# EAGLE design PLT-01-RevEe (EAGLE 9.6.2)
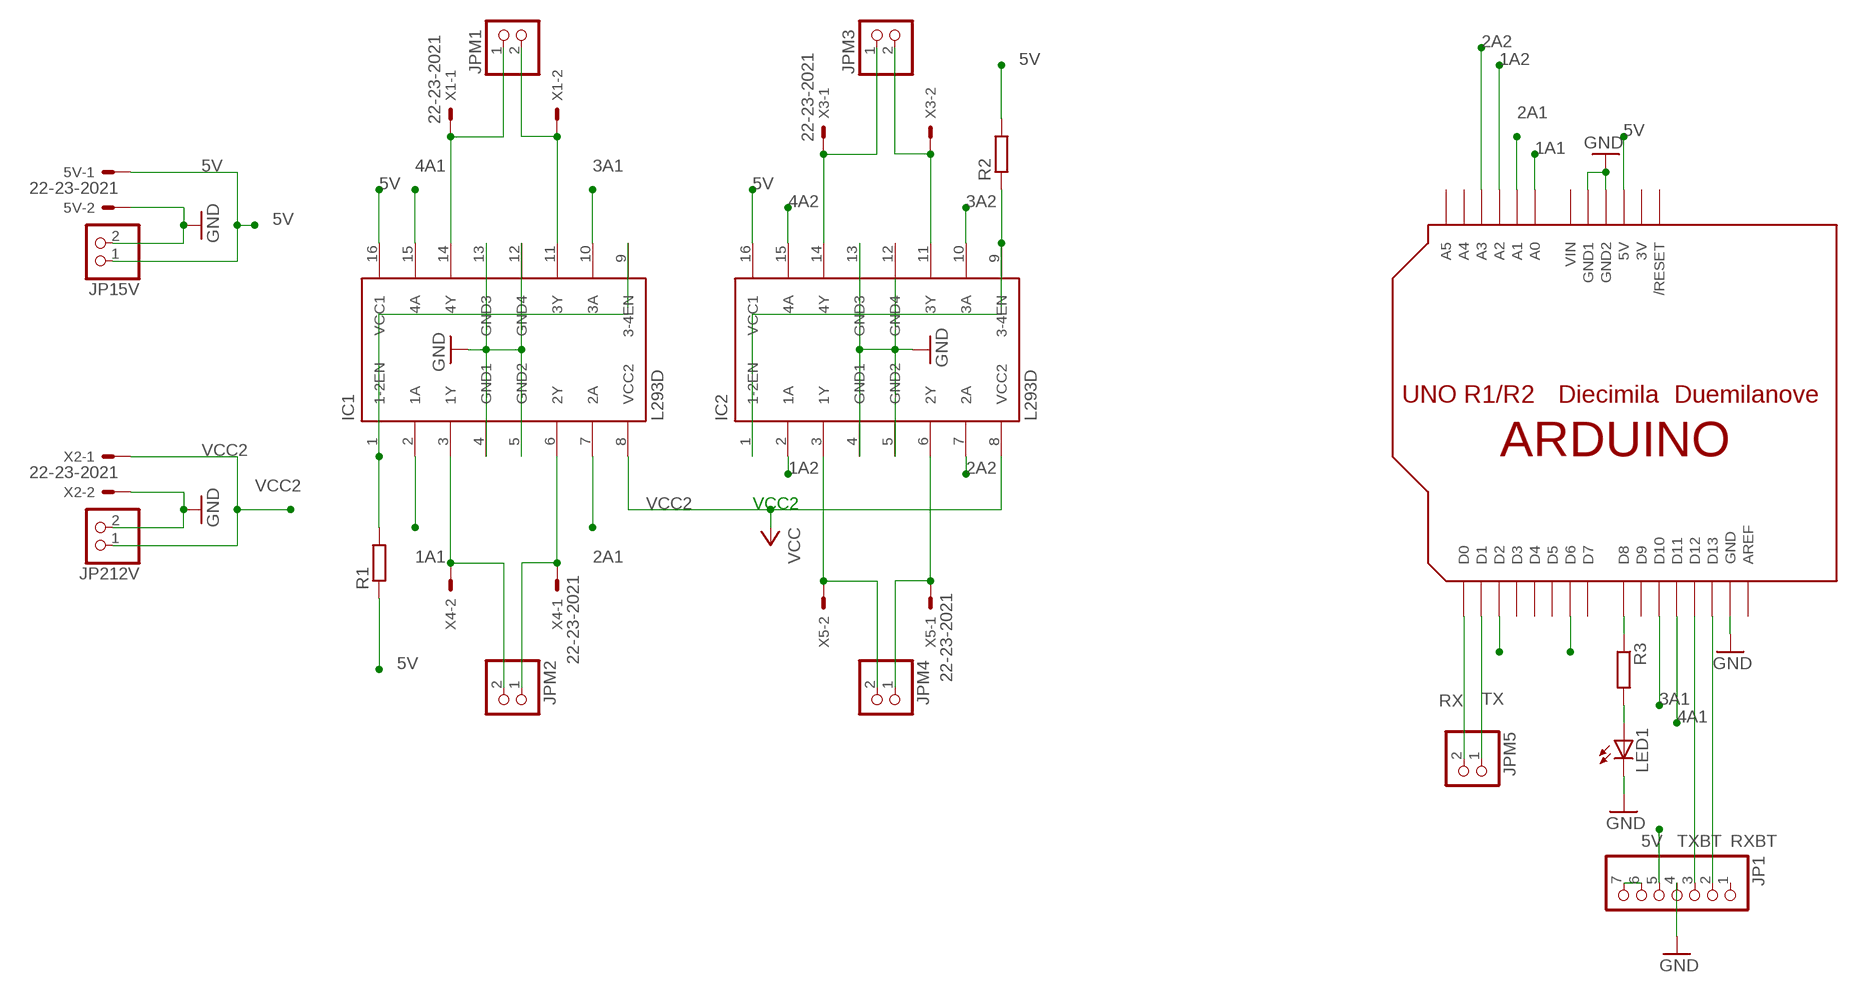
[diagram p0: schematic, sheet 1]

## Parts
5V  22-23-2021  [22-23-2021]
IC1  L293D  [DIL16]
IC2  L293D  [DIL16]
JP1  PINHD-1X7  [1X07]
JP15V  PINHD-1X2  [1X02]
JP212V  PINHD-1X2  [1X02]
JPM1  PINHD-1X2  [1X02]
JPM2  PINHD-1X2  [1X02]
JPM3  PINHD-1X2  [1X02]
JPM4  PINHD-1X2  [1X02]
JPM5  PINHD-1X2  [1X02]
LED1  LED5MM  [LED5MM]
R1  R-EU_0207/10  [0207/10]
R2  R-EU_0207/10  [0207/10]
R3  R-EU_0207/10  [0207/10]
U$1  ARDUINOUNO  [ARDUINO]
X1  22-23-2021  [22-23-2021]
X2  22-23-2021  [22-23-2021]
X3  22-23-2021  [22-23-2021]
X4  22-23-2021  [22-23-2021]
X5  22-23-2021  [22-23-2021]

## Nets
1A1: IC1.2(1A) U$1.A0
1A2: IC2.2(1A) U$1.A2
2A1: IC1.7(2A) U$1.A1
2A2: IC2.7(2A) U$1.A3
3A1: IC1.10(3A) U$1.D10
3A2: IC2.10(3A) U$1.D2
4A1: IC1.15(4A) U$1.D11
4A2: IC2.15(4A) U$1.D6
5V: 5V.1 IC1.16(VCC1) IC2.16(VCC1) JP1.5 JP15V.1 R1.1 R2.2 U$1.5V
GND: 5V.2 IC1.4(GND1) IC1.5(GND2) IC1.12(GND4) IC1.13(GND3) IC2.4(GND1) IC2.5(GND2) IC2.13(GND3) JP1.4 JP15V.2 JP212V.2 LED1.K(C) U$1.GND U$1.GND1 U$1.GND2 X2.2
N$1: IC1.3(1Y) JPM2.2 X4.2
N$2: IC1.6(2Y) JPM2.1 X4.1
N$3: IC2.3(1Y) JPM4.2 X5.2
N$4: IC2.6(2Y) JPM4.1 X5.1
N$5: IC2.14(4Y) JPM3.1 X3.1
N$6: IC2.11(3Y) JPM3.2 X3.2
N$7: IC1.14(4Y) JPM1.1 X1.1
N$8: IC1.11(3Y) JPM1.2 X1.2
N$9: IC2.1(1-2EN) IC2.9(3-4EN) R2.1
N$10: R3.1 U$1.D8
N$11: IC1.1(1-2EN) IC1.9(3-4EN) R1.2
N$12: LED1.A R3.2
N$13: JP1.6 JP1.7
RX: JPM5.2 U$1.D0
RXBT: JP1.2 U$1.D13
TX: JPM5.1 U$1.D1
TXBT: JP1.3 U$1.D12
VCC2: IC1.8(VCC2) IC2.8(VCC2) JP212V.1 X2.1 ; supply symbol labelled VCC
Unconnected: JP1.1 U$1.A4 U$1.A5 U$1.AREF U$1.D3 U$1.D4 U$1.D5 U$1.D7 U$1.D9 U$1.RESET(/RESET)

## Notes on the sheet
- VCC2

## Power pins joined to a net without a drawn wire
3V: U$1.3V
GND4: IC2.12(GND4)
VIN: U$1.VIN

## Library data of the parts
5V X1-X5 = con-molex:22-23-2021: .100" (2.54mm) Center Header - 2 Pin; MF: MOLEX; MPN: 22-23-2021; OC_FARNELL: 1462926; OC_NEWARK: 25C3832
IC1 IC2 = st-microelectronics:L293D: PUSH-PULL 4 CHANNEL DRIVER; MPN: L293D; OC_FARNELL: 9589619; OC_NEWARK: 56P8249
JP1 = pinhead:PINHD-1X7: PIN HEADER
JP15V JP212V JPM1-JPM5 = pinhead:PINHD-1X2: PIN HEADER
LED1 = led:LED: LED OSRAM: - CHIPLED LG R971, LG N971, LY N971, LG Q971, LY Q971, LO R971, LY R971 LH N974, LH R974 LS Q976, LO Q976, LY Q976 LO Q996 - Hyper CHIPLED LW Q18S LB Q993, LB Q99A, LB R99A - SideLED LS A670, LO A670, LY A670, LG A670, LP A670 LB A673, LV A673, LT A673, LW A673 LH A674 LY A675 LS A676, LA A676, LO A676, LY A676, LW A676 LS A679, LY A679, LG A679 - Hyper Micro SIDELED® LS Y876, LA Y876, LO Y876, LY Y876 LT Y87S - SmartLED LW L88C, LW L88S LB L89C, LB L89S, LG L890 LS L89K, LO L89K, LY L89K LS L896, LA L896, LO L896, LY L896 - TOPLED LS T670, LO T670, LY T670, LG T670, LP T670 LSG T670, LSP T670, LSY T670, LOP T670, LYG T670 LG T671, LOG T671, LSG T671 LB T673, LV T673, LT T673, LW T673 LH T674 LS T676, LA T676, LO T676, LY T676, LB T676, LH T676, LSB T676, LW T676 LB T67C, LV T67C, LT T67C, LS T67K, LO T67K, LY T67K, LW E67C LS E67B, LA E67B, LO E67B, LY E67B, LB E67C, LV E67C, LT E67C LW T67C LS T679, LY T679, LG T679 LS T770, LO T770, LY T770, LG T770, LP T770 LB T773, LV T773, LT T773, LW T773 LH T774 LS E675, LA E675, LY E675, LS T675 LS T776, LA T776, LO T776, LY T776, LB T776 LHGB T686 LT T68C, LB T68C - Hyper Mini TOPLED® LB M676 - Mini TOPLED Santana® LG M470 LS M47K, LO M47K, LY M47K Source: http://www.osram.convergy.de LUXEON: - LUMILED® LXK2-PW12-R00, LXK2-PW12-S00, LXK2-PW14-U00, LXK2-PW14-V00 LXK2-PM12-R00, LXK2-PM12-S00, LXK2-PM14-U00 LXK2-PE12-Q00, LXK2-PE12-R00, LXK2-PE12-S00, LXK2-PE14-T00, LXK2-PE14-U00 LXK2-PB12-K00, LXK2-PB12-L00, LXK2-PB12-M00, LXK2-PB14-N00, LXK2-PB14-P00, LXK2-PB14-Q00 LXK2-PR12-L00, LXK2-PR12-M00, LXK2-PR14-Q00, LXK2-PR14-R00 LXK2-PD12-Q00, LXK2-PD12-R00, LXK2-PD12-S00 LXK2-PH12-R00, LXK2-PH12-S00 LXK2-PL12-P00, LXK2-PL12-Q00, LXK2-PL12-R00 Source: www.luxeon.com KINGBRIGHT: KA-3528ASYC Source: www.kingbright.com
R1-R3 = resistor:R-EU_: RESISTOR, European symbol
U$1 = adafruit:ARDUINO: Arduino Diecimila/Duemilanove Make a shield with ease, this package has all the named pins as well as the two mounting drill holes and an outline of the USB and DC power connector. The outline is on the DIMENSION layer, so if your board house uses it they will cut the outline to match. http://www.ladyada.net/library/pcb/eaglelibrary.html

## Board
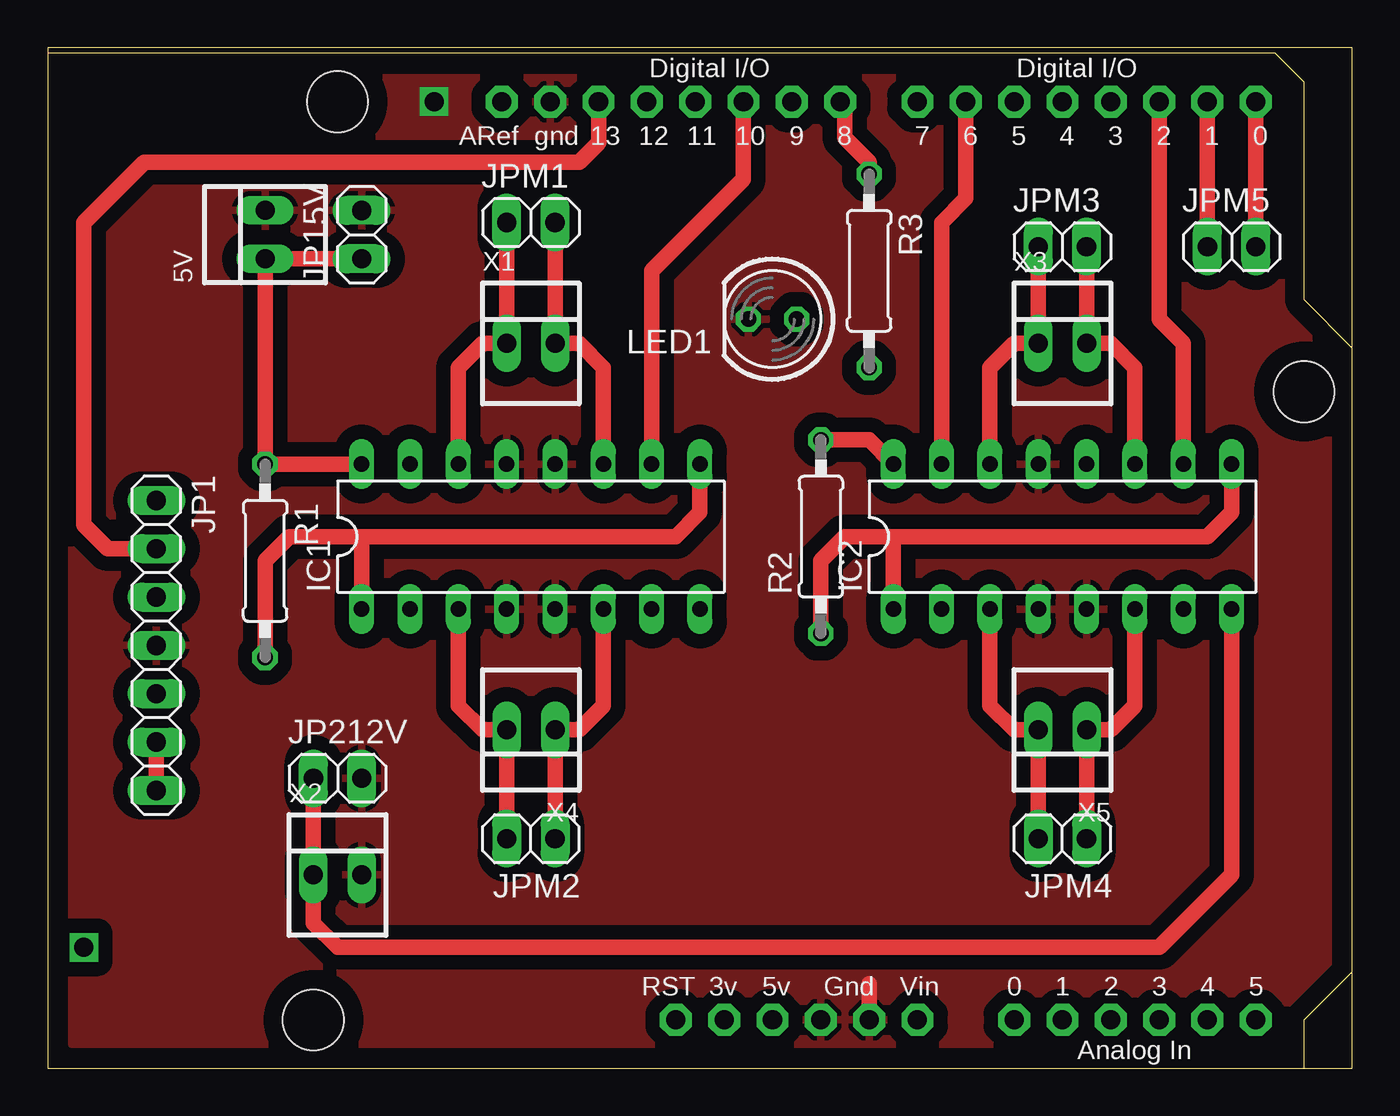
[diagram p1: board, top side]
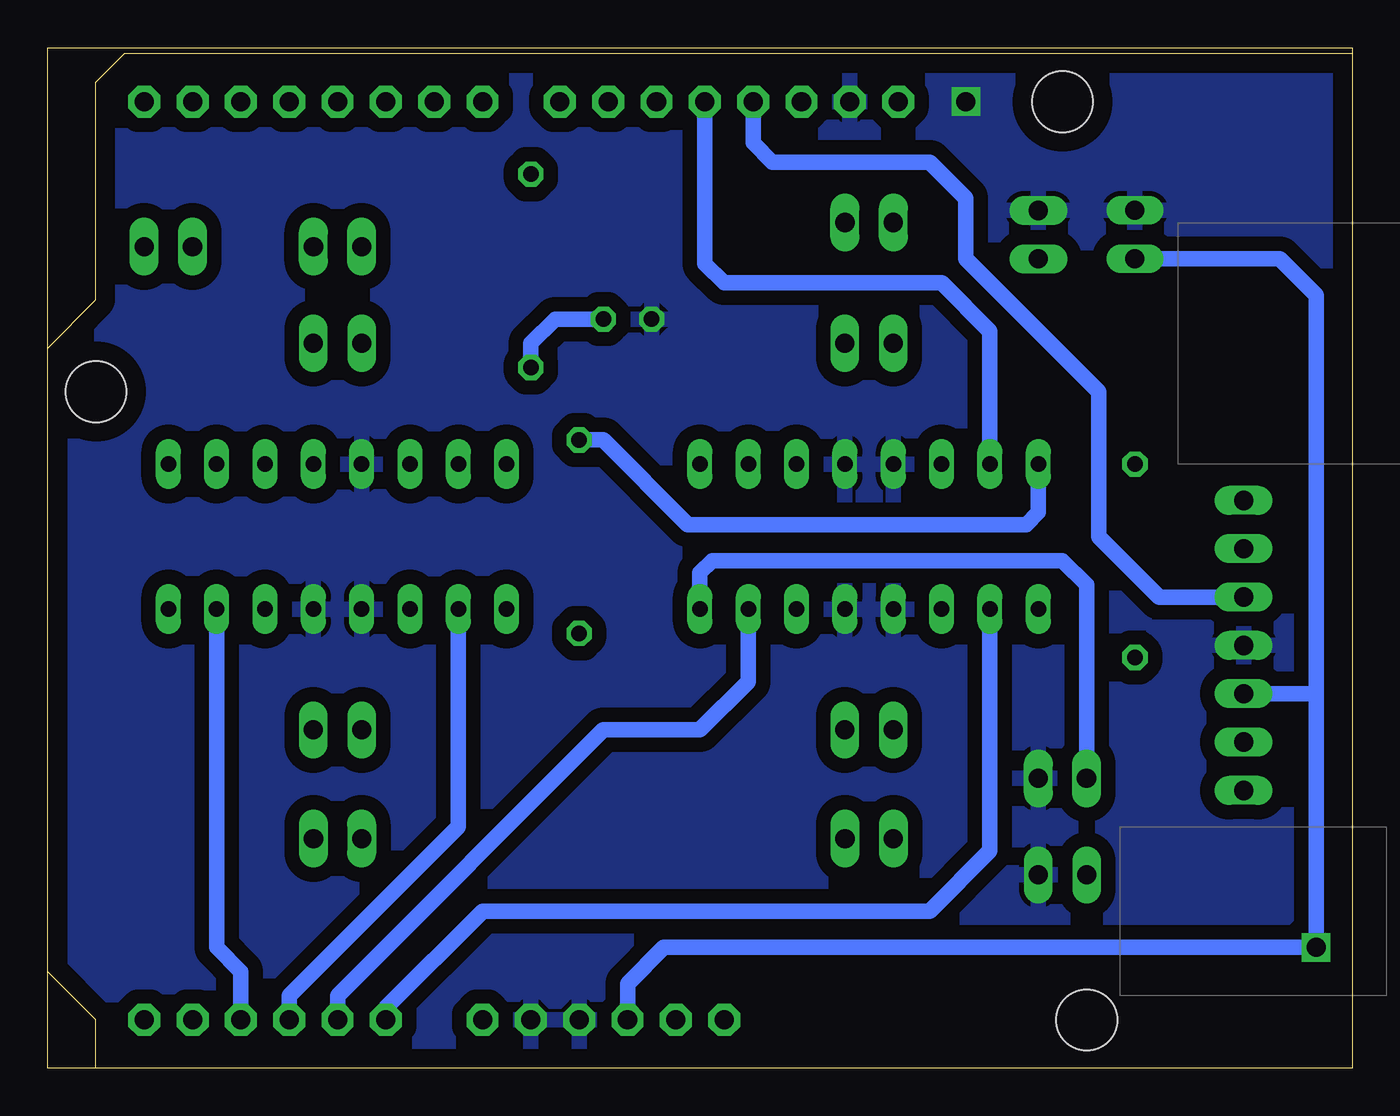
[diagram p2: board, bottom side, seen from below]

Size 68.58 x 53.64 mm. Coordinates in mm from the lower left corner, seen from the top.
Outline: 0,0 68.56,0 68.56,53.64 0,53.64 0,0
Copper layers (1*16): Top 0.035mm / dielectric 1.5mm / Bottom 0.035mm
Design rules "default *": minimum track width 10mil, minimum drill 24mil, track to track 30mil, track to pad 30mil, pad to pad 30mil, via to via 30mil, smd to smd 30mil, copper to edge 40mil, drill to drill 8mil, minimum pad ring 10mil, minimum via ring 8mil, stop-mask expansion 4mil, vias tented up to drill 0mil, thermal gap 10mil

### Footprints (pad centres in the part's own frame; a part is rotated, then mirrored left to right if it is on the bottom)
22-23-2021 = drill 1 long: 1 -1.27,0; 2 1.27,0
DIL16 = drill 0.813 long: 1 -8.89,-3.81; 2 -6.35,-3.81; 3 -3.81,-3.81; 4 -1.27,-3.81; 5 1.27,-3.81; 6 3.81,-3.81; 7 6.35,-3.81; 8 8.89,-3.81; 9 8.89,3.81; 10 6.35,3.81; 11 3.81,3.81; 12 1.27,3.81; 13 -1.27,3.81; 14 -3.81,3.81; 15 -6.35,3.81; 16 -8.89,3.81
1X07 = drill 1.016 long: 1 -7.62,0; 2 -5.08,0; 3 -2.54,0; 4 0,0; 5 2.54,0; 6 5.08,0; 7 7.62,0
1X02 = drill 1.016 long: 1 -1.27,0; 2 1.27,0
LED5MM = drill 0.813 octagon: A -1.27,0; K 1.27,0
0207/10 = drill 0.813 octagon: 1 -5.08,0; 2 5.08,0
ARDUINO = drill 1 pad 1.676 octagon: 3V 35.56,2.54; 5V 38.1,2.54; A0 50.8,2.54; A1 53.34,2.54; A2 55.88,2.54; A3 58.42,2.54; A4 60.96,2.54; A5 63.5,2.54; AREF 23.876,50.8; D0 63.5,50.8; D1 60.96,50.8; D2 58.42,50.8; D3 55.88,50.8; D4 53.34,50.8; D5 50.8,50.8; D6 48.26,50.8; D7 45.72,50.8; D8 41.656,50.8; D9 39.116,50.8; D10 36.576,50.8; D11 34.036,50.8; D12 31.496,50.8; D13 28.956,50.8; GND 26.416,50.8; GND1 43.18,2.54; GND2 40.64,2.54; RESET 33.02,2.54; VIN 45.72,2.54 | hole 3.2: 15.24,50.8; 66.04,35.56; 13.97,2.54

### Placement (x,y rotation side)
5V  11.43,43.81 90 top
IC1  25.4,27.94 0 top
IC2  53.34,27.94 0 top
JP1  5.71,22.23 270 top
JP15V  16.51,43.81 90 top
JP212V  15.24,15.24 0 top
JPM1  25.4,44.45 0 top
JPM2  25.4,12.06 180 top
JPM3  53.34,43.18 0 top
JPM4  53.34,12.06 180 top
JPM5  62.23,43.18 0 top
LED1  38.1,39.37 180 top
R1  11.43,26.67 270 top
R2  40.64,27.94 90 top
R3  43.18,41.91 270 top
U$1  0,0 0 top
X1  25.4,38.1 0 top
X2  15.24,10.16 0 top
X3  53.34,38.1 0 top
X4  25.4,17.78 180 top
X5  53.34,17.78 180 top

### Tracks (layer width: path | path; a pad name or v marks a point on that pad's centre or on a via)
1A1
  Bottom 0.813: U$1.A0 50.8,3.18 45.72,8.25 22.22,8.25 19.05,11.43 IC1.2
1A2
  Bottom 0.813: U$1.A2 55.88,3.81 46.99,12.7 IC2.2
2A1
  Bottom 0.813: U$1.A1 53.34,3.81 39.37,17.78 34.29,17.78 31.75,20.32 IC1.7
2A2
  Bottom 0.813: U$1.A3 58.42,5.08 59.69,6.35 IC2.7
3A1
  Top 0.813: IC1.10 31.75,41.91 36.58,46.74 U$1.D10
3A2
  Top 0.813: U$1.D2 58.42,39.37 59.69,38.1 IC2.10
4A1
  Bottom 0.813: IC1.15 19.05,38.73 21.59,41.27 33.02,41.27 34.04,42.29 U$1.D11
4A2
  Top 0.813: IC2.15 46.99,44.45 48.26,45.72 U$1.D6
5V  (via drill 1)
  Top 0.813: R2.2 43.18,33.02 IC2.16 | IC1.16 R1.1 5V.1 JP15V.1
  Bottom 0.813: U$1.5V 38.1,4.45 36.2,6.35 v1.9,6.35 1.9,19.69 | R2.2 39.37,33.02 34.92,28.57 17.14,28.57 16.51,29.21 IC1.16 | 1.9,19.69 1.9,40.64 3.81,42.54 5V.1 | JP1.5 1.9,19.69
GND  (via drill 1)
  Top 0.813: U$1.GND1 43.18,4.45
  other vias: 20.32,50.8
  pour Top: 1.27,52.07 1.27,1.27 67.31,1.27 67.31,52.07
  pour Bottom: 1.27,52.07 1.27,5.08 1.27,1.27 67.31,1.27 67.31,52.07
N$1
  Top 0.813: IC1.3 21.59,19.05 22.86,17.78 X4.2 JPM2.2
N$2
  Top 0.813: IC1.6 29.21,19.05 27.94,17.78 X4.1 JPM2.1
N$3
  Top 0.813: JPM4.2 X5.2 50.8,17.78 49.53,19.05 IC2.3
N$4
  Top 0.813: JPM4.1 X5.1 55.88,17.78 57.15,19.05 IC2.6
N$5
  Top 0.813: IC2.14 49.53,36.83 50.8,38.1 X3.1 JPM3.1
N$6
  Top 0.813: JPM3.2 X3.2 55.88,38.1 57.15,36.83 IC2.11
N$7
  Top 0.813: IC1.14 21.59,36.83 22.86,38.1 X1.1 JPM1.1
N$8
  Top 0.813: IC1.11 29.21,36.83 27.94,38.1 X1.2 JPM1.2
N$9
  Top 0.813: R2.1 40.64,26.67 41.91,27.94 44.45,27.94 | 44.45,27.94 60.96,27.94 62.23,29.21 IC2.9 | IC2.1 44.45,27.94
N$10
  Top 0.813: R3.1 43.18,47.62 41.91,48.89 41.91,50.55 U$1.D8
N$11
  Top 0.813: 16.51,27.94 12.7,27.94 11.43,26.67 R1.2 | 16.51,27.94 33.02,27.94 34.29,29.21 IC1.9 | IC1.1 16.51,27.94
N$12
  Bottom 0.813: LED1.A 41.91,39.37 43.18,38.1 R3.2
N$13
  Top 0.813: JP1.6 JP1.7
RX
  Top 0.813: JPM5.2 U$1.D0
RXBT
  Top 0.813: JP1.2 3.17,27.3 2.54,27.94 1.9,28.57 1.9,44.45 5.08,47.62 27.94,47.62 28.96,48.64 U$1.D13
TX
  Top 0.813: JPM5.1 U$1.D1
TXBT
  Bottom 0.813: JP1.3 10.16,24.77 13.34,27.94 13.34,35.56 20.32,42.54 20.32,45.72 22.22,47.62 30.48,47.62 31.5,48.64 U$1.D12
VCC2
  Top 0.813: IC2.8 62.23,10.16 58.42,6.35 15.24,6.35 13.97,7.62 X2.1 JP212V.1
  Bottom 0.813: IC1.8 34.29,26.04 33.66,26.67 15.24,26.67 13.97,25.4 JP212V.1